# Altium schematic sheet pinbits.SchDoc
size A4
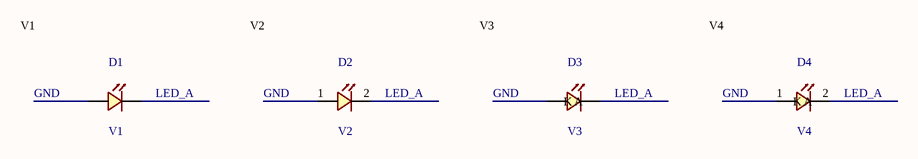
[diagram p0: pinbits.SchDoc]

## Parts
D1  V1
D2  V2
D3  V3
D4  V4

## Nets
GND: D1.1(A) D2.1(A) D3.1(A) D4.1(A)
LED_A: D1.2(K) D2.2(K) D3.2(K) D4.2(K)

## Notes on the sheet
- V1
- V2
- V3
- V4

## Library data of the parts
D1 = LED_V1
D2 = LED_V2
D3 = LED_V3
D4 = LED_V4